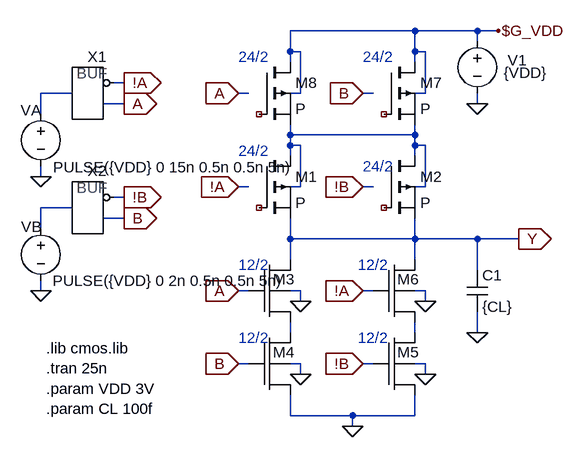
[diagram p0: schematic hw1-gate.asc]
hw1-gate.asc, the LTspice schematic file:
Version 4
SHEET 1 1292 680
WIRE -992 -512 -1184 -512
WIRE -896 -512 -992 -512
WIRE -864 -512 -896 -512
WIRE -896 -496 -896 -512
WIRE -1184 -480 -1184 -512
WIRE -1168 -480 -1184 -480
WIRE -992 -480 -992 -512
WIRE -976 -480 -992 -480
WIRE -1184 -464 -1184 -480
WIRE -992 -464 -992 -480
WIRE -1440 -432 -1456 -432
WIRE -1520 -416 -1568 -416
WIRE -1248 -416 -1264 -416
WIRE -1168 -416 -1168 -480
WIRE -1168 -416 -1184 -416
WIRE -1056 -416 -1072 -416
WIRE -976 -416 -976 -480
WIRE -976 -416 -992 -416
WIRE -1440 -400 -1472 -400
WIRE -896 -400 -896 -416
WIRE -1568 -384 -1568 -416
WIRE -1184 -352 -1184 -368
WIRE -992 -352 -992 -368
WIRE -992 -352 -1184 -352
WIRE -1184 -336 -1184 -352
WIRE -1168 -336 -1184 -336
WIRE -992 -336 -992 -352
WIRE -976 -336 -992 -336
WIRE -1184 -320 -1184 -336
WIRE -992 -320 -992 -336
WIRE -1568 -288 -1568 -304
WIRE -1248 -272 -1264 -272
WIRE -1168 -272 -1168 -336
WIRE -1168 -272 -1184 -272
WIRE -1056 -272 -1072 -272
WIRE -976 -272 -976 -336
WIRE -976 -272 -992 -272
WIRE -1440 -256 -1456 -256
WIRE -1520 -240 -1568 -240
WIRE -1440 -224 -1472 -224
WIRE -1568 -208 -1568 -240
WIRE -1184 -192 -1184 -224
WIRE -992 -192 -992 -224
WIRE -992 -192 -1184 -192
WIRE -896 -192 -992 -192
WIRE -832 -192 -896 -192
WIRE -1184 -160 -1184 -192
WIRE -992 -160 -992 -192
WIRE -896 -144 -896 -192
WIRE -1568 -112 -1568 -128
WIRE -1248 -112 -1264 -112
WIRE -1168 -112 -1184 -112
WIRE -1056 -112 -1072 -112
WIRE -976 -112 -992 -112
WIRE -1168 -96 -1168 -112
WIRE -976 -96 -976 -112
WIRE -1184 -48 -1184 -64
WIRE -992 -48 -992 -64
WIRE -896 -48 -896 -80
WIRE -1248 0 -1264 0
WIRE -1168 0 -1184 0
WIRE -1056 0 -1072 0
WIRE -976 0 -992 0
WIRE -1168 16 -1168 0
WIRE -976 16 -976 0
WIRE -1184 80 -1184 48
WIRE -1088 80 -1184 80
WIRE -992 80 -992 48
WIRE -992 80 -1088 80
WIRE -1088 96 -1088 80
FLAG -1088 96 0
FLAG -832 -192 Y
IOPIN -832 -192 Out
FLAG -1264 -112 A
IOPIN -1264 -112 In
FLAG -1264 0 B
IOPIN -1264 0 In
FLAG -1568 -288 0
FLAG -1440 -400 A
IOPIN -1440 -400 Out
FLAG -1568 -112 0
FLAG -896 -400 0
FLAG -864 -512 $G_VDD
FLAG -896 -48 0
FLAG -1168 -96 0
FLAG -1168 16 0
FLAG -976 -96 0
FLAG -976 16 0
FLAG -1264 -272 !A
IOPIN -1264 -272 In
FLAG -1264 -416 A
IOPIN -1264 -416 In
FLAG -1072 -416 B
IOPIN -1072 -416 In
FLAG -1072 -272 !B
IOPIN -1072 -272 In
FLAG -1072 -112 !A
IOPIN -1072 -112 In
FLAG -1072 0 !B
IOPIN -1072 0 In
FLAG -1440 -432 !A
IOPIN -1440 -432 Out
FLAG -1440 -224 B
IOPIN -1440 -224 Out
FLAG -1440 -256 !B
IOPIN -1440 -256 Out
SYMBOL pmos -1040 -320 R0
SYMATTR InstName M2
SYMATTR Value2 L=0.6u W=7.2u
SYMATTR SpiceModel ""
SYMATTR Value P
SYMBOL nmos -1232 -48 R0
SYMATTR InstName M4
SYMATTR Value2 l=0.6u w=3.6u
SYMATTR Value N
SYMBOL pmos -1232 -320 R0
SYMATTR InstName M1
SYMATTR Value2 L=0.6u W=7.2u
SYMATTR SpiceModel ""
SYMATTR Value P
SYMBOL nmos -1232 -160 R0
SYMATTR InstName M3
SYMATTR Value2 l=0.6u w=3.6u
SYMATTR Value N
SYMBOL voltage -1568 -400 R0
WINDOW 123 0 0 Left 2
WINDOW 39 0 0 Left 2
WINDOW 3 19 98 Left 2
WINDOW 0 -31 10 Left 2
SYMATTR Value PULSE({VDD} 0 15n 0.5n 0.5n 5n)
SYMATTR InstName VA
SYMBOL voltage -1568 -224 R0
WINDOW 123 0 0 Left 2
WINDOW 39 0 0 Left 2
WINDOW 3 18 96 Left 2
WINDOW 0 -30 13 Left 2
SYMATTR Value PULSE({VDD} 0 2n 0.5n 0.5n 5n)
SYMATTR InstName VB
SYMBOL voltage -896 -512 R0
WINDOW 123 0 0 Left 2
WINDOW 39 0 0 Left 2
WINDOW 0 47 45 Left 2
WINDOW 3 41 64 Left 2
SYMATTR InstName V1
SYMATTR Value {VDD}
SYMBOL cap -912 -144 R0
SYMATTR InstName C1
SYMATTR Value {CL}
SYMBOL nmos -1040 -48 R0
SYMATTR InstName M5
SYMATTR Value2 l=0.6u w=3.6u
SYMATTR Value N
SYMBOL nmos -1040 -160 R0
SYMATTR InstName M6
SYMATTR Value2 l=0.6u w=3.6u
SYMATTR Value N
SYMBOL pmos -1040 -464 R0
SYMATTR InstName M7
SYMATTR Value2 L=0.6u W=7.2u
SYMATTR SpiceModel ""
SYMATTR Value P
SYMBOL pmos -1232 -464 R0
SYMATTR InstName M8
SYMATTR Value2 L=0.6u W=7.2u
SYMATTR SpiceModel ""
SYMATTR Value P
SYMBOL buf2 -1456 -416 R0
SYMATTR InstName X1
SYMBOL buf2 -1456 -240 R0
SYMATTR InstName X2
TEXT -1560 -24 Left 2 !.lib cmos.lib\n.tran 25n\n.param VDD 3V\n.param CL 100f
TEXT -1264 -152 Left 2 ;12/2
TEXT -1264 -40 Left 2 ;12/2
TEXT -1080 -40 Left 2 ;12/2
TEXT -1080 -152 Left 2 ;12/2
TEXT -1264 -472 Left 2 ;24/2
TEXT -1264 -328 Left 2 ;24/2
TEXT -1072 -472 Left 2 ;24/2
TEXT -1072 -304 Left 2 ;24/2

The netlist it stands for:
* hw1-gate.asc
* M2: P L=0.6u W=7.2u (symbol pmos not certain, pin order unknown); nets seen at it: N002, Y
M4 N004 B 0 0 N l=0.6u w=3.6u
* M1: P L=0.6u W=7.2u (symbol pmos not certain, pin order unknown); nets seen at it: N002, Y
M3 Y A N004 0 N l=0.6u w=3.6u
VA N001 0 PULSE({VDD} 0 15n 0.5n 0.5n 5n)
VB N003 0 PULSE({VDD} 0 2n 0.5n 0.5n 5n)
V1 $G_VDD 0 {VDD}
C1 Y 0 {CL}
M5 N005 !B 0 0 N l=0.6u w=3.6u
M6 Y !A N005 0 N l=0.6u w=3.6u
* M7: P L=0.6u W=7.2u (symbol pmos not certain, pin order unknown); nets seen at it: $G_VDD, N002
* M8: P L=0.6u W=7.2u (symbol pmos not certain, pin order unknown); nets seen at it: $G_VDD, N002
XX1 N001 !A A buf2  ; pins IN !OUT OUT
XX2 N003 !B B buf2  ; pins IN !OUT OUT
.model NMOS NMOS
.model PMOS PMOS
.lib standard.mos
.lib cmos.lib
.tran 25n
.param VDD 3V
.param CL 100f
* 12/2
* 12/2
* 12/2
* 12/2
* 24/2
* 24/2
* 24/2
* 24/2
.backanno
.end